# EasyEDA Pro project Motor_Driver.eprj, board PCB1
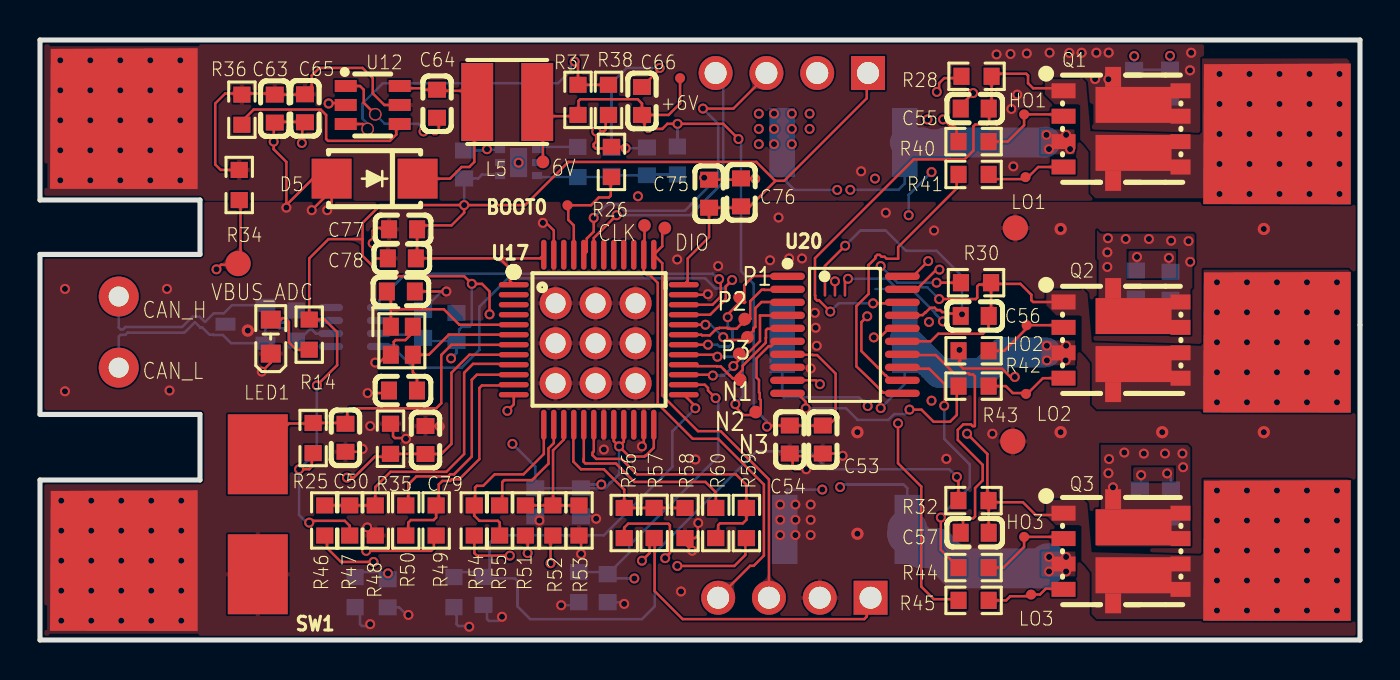
[diagram p2: board, top side]
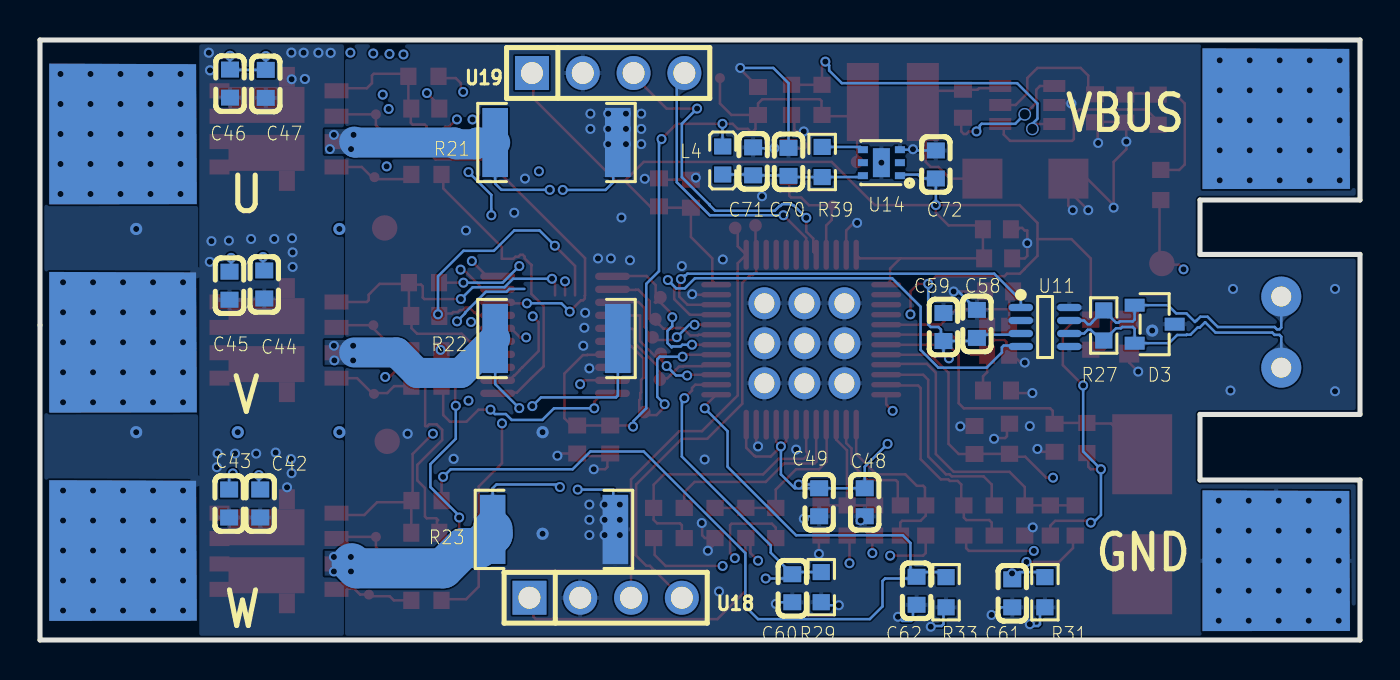
[diagram p3: board, bottom side, seen from below]

Outline 66 x 30 mm; copper layers: Top Layer, Inner1, Inner2, Bottom Layer. Coordinates in mm from the lower left corner of the outline.
Outline path: 0,30 66,30 66,0 0,0 0,8 8,8 8,11.28 0,11.28 0,19.28 8,19.28 8,22 0,22 0,30
Stack: Top Layer 0.035mm 外层铜厚1oz / Dielectric1 0.2104mm 7628 RC49% 8.6mil / Inner1 0.0152mm 内层铜厚 / Dielectric2 1.065mm 1.1mm H/HOZ Copper / Inner2 0.0152mm 内层铜厚 / Dielectric3 0.2104mm 7628 RC49% 8.6mil / Bottom Layer 0.035mm 外层铜厚1oz

## Design rules (mm)
net CANH: CAN
net CANL: CAN
template: 自定义配置
spacing copperThickness1oz (default): track to track 0.102, other pairs 0.152 to 0.3
spacing copperThickness2oz: track to track 0.203, other pairs 0.152 to 0.3
track width copperThickness1oz (default): min 0.127, default 0.254, max 2.54
track width copperThickness2oz: min 0.203, default 0.254, max 2.54
differential pair differentialPair (default): width min 0.127, default 0.254, max 2.54; gap min 0.152, default 0.152
via viaSize (default): diameter min 0.5, default 0.61, max 10; hole min 0.3, default 0.305, max 6.3

## Placement (name value [footprint] x y rotation side)
+6V  -  [Test-Point-0.5mm]  32 28.09 0 top
BOOT0  -  [Test-Point-0.5mm]  26.37 21.74 0 top
C42  10uF  [C0603]  54.99 6.82 270 bottom
C43  4.7uF  [C0603]  56.54 6.82 270 bottom
C44  10uF  [C0603]  54.79 17.78 270 bottom
C45  4.7uF  [C0603]  56.53 17.72 270 bottom
C46  10uF  [C0603]  56.5 27.82 270 bottom
C47  4.7uF  [C0603]  54.71 27.81 270 bottom
C48  10nF  [C0603]  24.76 6.89 90 bottom
C49  1uF  [C0603]  27.04 6.89 90 bottom
C50  100nF  [C0603]  15.27 10.11 90 top
C53  100nF  [C0603]  39.14 10.02 90 top
C54  10uF  [C0603]  37.49 10.02 90 top
C55  470nF  [C0603]  46.74 26.57 180 top
C56  470nF  [C0603]  46.74 16.2 180 top
C57  470nF  [C0603]  46.74 5.36 0 top
C58  100nF  [C0603]  19.15 15.8 90 bottom
C59  1uF  [C0603]  20.83 15.65 90 bottom
C60  68nF  [C0603]  28.38 2.59 90 bottom
C61  68nF  [C0603]  17.39 2.33 90 bottom
C62  68nF  [C0603]  22.17 2.46 90 bottom
C63  4.7uF  [C0603]  11.74 26.57 90 top
C64  100nF  [C0603]  19.85 26.81 270 top
C65  100nF  [C0603]  13.25 26.58 90 top
C66  10uF  [C0603]  30.1 26.95 270 top
C70  100nF  [C0603]  28.57 23.91 270 bottom
C71  1uF  [C0603]  30.34 23.93 270 bottom
C72  4.7uF  [C0603]  21.21 23.78 270 bottom
C75  100nF  [C0603]  33.45 22.31 270 top
C76  1uF  [C0603]  35.05 22.38 270 top
C77  100nF  [C0603]  18.15 20.53 0 top
C78  1uF  [C0603]  18.09 19.08 0 top
C79  100nF  [C0603]  19.27 10 270 top
C82  10pF  [C0603]  18.04 17.43 180 top
C83  10pF  [C0603]  18.15 12.47 0 top
D3  PESD2CANFD24V-TR  [SOT-23-3_L2.9-W1.3-P1.90-LS2.4-BR]  10.27 15.79 0 bottom
D5  SS310  [DO-214AC_L4.3-W2.4-LS4.7-RD]  16.73 23.07 180 top
HO1  -  [Test-Point-0.5mm]  49.21 26.28 0 top
HO2  -  [Test-Point-0.5mm]  49.33 15.74 0 top
HO3  -  [Test-Point-0.5mm]  49.21 5.16 0 top
L4  BLM18PG121SN1D  [L0603]  31.87 23.98 270 bottom
L5  33uH  [IND-SMD_L4.0-W4.0_FNR40XXS]  23.36 26.9 0 top
LED1  LED  [LED0603-FD]  11.54 15.17 270 top
LO1  -  [Test-Point-0.5mm]  49.28 23.14 0 top
LO2  -  [Test-Point-0.5mm]  49.3 12.31 0 top
LO3  -  [Test-Point-0.5mm]  49.55 2.27 0 top
NOREF  -  [Pad_e484]  3.94 13.62 0 top
NOREF#2  -  [Pad_e2578]  61.85 14.88 0 top
NOREF#3  -  [Pad_e12919]  25.78 12.84 0 top
NOREF#4  -  [Pad_e482]  3.94 17.17 0 top
NOREF#5  -  [Pad_e2576]  61.85 4.47 0 top
NOREF#6  -  [Pad_e8259]  34.98 17.14 0 top
NOREF#7  -  [Pad_e8297]  48.64 9.93 0 top
NOREF#8  -  [Pad_e2573]  4.19 3.96 0 top
NOREF#9  -  [Pad_e2575]  61.85 14.88 0 top
NOREF#10  -  [Pad_e12925]  29.78 16.84 0 top
NOREF#11  -  [Pad_e8261]  35.24 16.05 0 top
NOREF#12  -  [Pad_e12924]  27.78 16.84 0 top
NOREF#13  -  [Pad_e8267]  35.79 11.4 0 top
NOREF#14  -  [Pad_e8296]  48.77 20.6 0 top
NOREF#15  -  [Pad_e2579]  61.85 4.47 0 top
NOREF#16  -  [Pad_e8264]  35.38 15.13 0 top
NOREF#17  -  [Pad_e2574]  61.85 25.3 0 top
NOREF#18  -  [Pad_e8265]  34.96 14.31 0 top
NOREF#19  -  [Pad_e12921]  29.78 12.84 0 top
NOREF#20  -  [Pad_e8281]  31.24 20.6 0 top
NOREF#21  -  [Pad_e2581]  4.19 26.06 0 top
NOREF#22  -  [Pad_e8280]  30.22 20.73 0 top
NOREF#23  -  [Pad_e12920]  29.78 14.84 0 top
NOREF#24  -  [Pad_e8266]  35.01 13.02 0 top
NOREF#25  -  [Pad_e2577]  61.85 25.3 0 top
NOREF#26  -  [Pad_e2580]  4.19 3.96 0 top
NOREF#27  -  [Pad_e12917]  27.78 12.84 0 top
NOREF#28  -  [Pad_e12923]  27.78 14.84 0 top
NOREF#29  -  [Pad_e12926]  25.78 14.84 0 top
NOREF#30  -  [Pad_e2572]  4.19 26.06 0 top
NOREF#31  -  [Pad_e8289]  25.15 23.9 0 top
NOREF#32  -  [Pad_e8298]  9.91 18.82 0 top
NOREF#33  -  [Pad_e12922]  25.78 16.84 0 top
Q1  XRS60V06F  [PDFN-8_L5.8-W4.9-P1.27-LS6.1-BL-1]  54.1 25.56 270 top
Q2  XRS60V06F  [PDFN-8_L5.8-W4.9-P1.27-LS6.1-BL-1]  54.1 15 270 top
Q3  XRS60V06F  [PDFN-8_L5.8-W4.9-P1.27-LS6.1-BL-1]  54.1 4.44 270 top
R14  1kΩ  [R0603]  13.46 15.27 270 top
R21  5mΩ  [R2512]  40.17 24.87 0 bottom
R22  5mΩ  [R2512]  40.17 15.08 0 bottom
R23  5mΩ  [R2512]  40.3 5.53 0 bottom
R25  10K  [R0603]  13.66 10.1 270 top
R26  10K  [R0603]  28.57 23.9 270 top
R27  120  [R0603]  12.81 15.73 90 bottom
R28  100K  [R0603]  46.83 28.18 0 top
R29  5.1K  [R0603]  26.94 2.64 90 bottom
R30  100K  [R0603]  46.8 17.87 0 top
R31  5.1K  [R0603]  15.75 2.39 90 bottom
R32  100K  [R0603]  46.67 6.97 0 top
R33  5.1K  [R0603]  20.7 2.39 90 bottom
R34  100K  [R0603]  9.96 22.75 90 top
R35  5.1K  [R0603]  17.53 10.06 270 top
R36  100K  [R0603]  10.09 26.52 270 top
R37  68K  [R0603]  26.9 27 270 top
R38  10K  [R0603]  28.42 27 90 top
R39  100K  [R0603]  26.89 23.9 270 bottom
R40  10  [R0603]  46.68 24.92 0 top
R41  10  [R0603]  46.68 23.28 180 top
R42  10  [R0603]  46.68 14.46 0 top
R43  10  [R0603]  46.68 12.69 180 top
R44  10  [R0603]  46.68 3.62 180 top
R45  10  [R0603]  46.68 1.98 180 top
R46  5K  [R0603]  14.24 5.98 90 top
R47  240K  [R0603]  15.48 5.98 270 top
R48  240K  [R0603]  16.76 5.98 90 top
R49  5K  [R0603]  19.81 5.98 270 top
R50  120K  [R0603]  18.29 5.98 270 top
R51  5K  [R0603]  24.27 5.98 90 top
R52  240K  [R0603]  25.64 5.98 270 top
R53  240K  [R0603]  26.95 5.98 90 top
R54  5K  [R0603]  21.71 5.98 270 top
R55  120K  [R0603]  22.98 5.98 270 top
R56  5K  [R0603]  29.21 5.85 90 top
R57  240K  [R0603]  30.71 5.85 270 top
R58  240K  [R0603]  32.25 5.85 90 top
R59  5K  [R0603]  35.32 5.85 270 top
R60  120K  [R0603]  33.79 5.85 270 top
SW1  -  [实验室微型开关]  9.37 1.25 90 top
U11  TCAN3414DDFR  [TSOT-23-8_L2.9-W1.6-P0.65-LS2.8-BR]  15.75 15.65 0 bottom
U12  LMR16006XDDCR  [SOT-23-6_L2.9-W1.6-P0.95-LS2.8-BR]  16.64 26.75 180 top
U14  NCP718AMT330TBG  [WDFN-6_L2.0-W2.0-P0.65-BL-EP]  23.93 23.87 90 bottom
U17  STM32G431CBT6  [LQFP-48_L7.0-W7.0-P0.50-LS9.0-BL]  27.94 15.01 270 top
U18  HX PZ2.54-1x4P ZZ  [HDR-TH_4P-P2.54-V-M]  37.72 2.11 180 bottom
U19  HX PZ2.54-1x4P ZZ  [HDR-TH_4P-P2.54-V-M]  37.59 28.35 180 bottom
U20  DRV8300DPWR  [TSSOP-20_L6.5-W4.4-P0.65-LS6.4-BL]  40.25 15.26 270 top
X1  16MHz  [CRYSTAL-SMD_4P-L2.0-W1.6-BL_XL7EL89COI-111YLC-16M]  18.09 14.96 270 top

## Footprints (pads in the part's own frame, mm; a bottom-side part is the same pattern mirrored in y, then rotated)
C0603
  rect 0.8x0.9 smd: 1(-0.7,0) 2(0.7,0)
CRYSTAL-SMD_4P-L2.0-W1.6-BL_XL7EL89COI-111YLC-16M
  rect 0.9x0.8 smd: 1(-0.7,-0.55) 2(0.7,-0.55) 3(0.7,0.55) 4(-0.7,0.55)
DO-214AC_L4.3-W2.4-LS4.7-RD
  rect 2x2 smd: 1(-2.15,0) 2(2.15,0)
HDR-TH_4P-P2.54-V-M
  rect 1.7x1.7 hole 1.1: 1(-3.81,0)
  round 1.7 hole 1.1: 2(-1.27,0) 3(1.27,0) 4(3.81,0)
IND-SMD_L4.0-W4.0_FNR40XXS
  rect 1.6x3.9 smd: 1(-1.5,0) 2(1.5,0)
L0603
  rect 0.8x0.864 smd: 1(-0.7,0) 2(0.7,0)
LED0603-FD
  rect 0.9x1 smd: 1(-0.85,0) 2(0.85,0)
LQFP-48_L7.0-W7.0-P0.50-LS9.0-BL
  oval 0.27x1.5 smd: 1(-2.75,-4.25) 2(-2.25,-4.25) 3(-1.75,-4.25) 4(-1.25,-4.25) 5(-0.75,-4.25) 6(-0.25,-4.25) 7(0.25,-4.25) 8(0.75,-4.25) 9(1.25,-4.25) 10(1.75,-4.25) 11(2.25,-4.25) 12(2.75,-4.25) 25(2.75,4.25) 26(2.25,4.25) 27(1.75,4.25) 28(1.25,4.25) 29(0.75,4.25) 30(0.25,4.25) 31(-0.25,4.25) 32(-0.75,4.25) 33(-1.25,4.25) 34(-1.75,4.25) 35(-2.25,4.25) 36(-2.75,4.25)
  oval 1.5x0.27 smd: 13(4.25,-2.75) 14(4.25,-2.25) 15(4.25,-1.75) 16(4.25,-1.25) 17(4.25,-0.75) 18(4.25,-0.25) 19(4.25,0.25) 20(4.25,0.75) 21(4.25,1.25) 22(4.25,1.75) 23(4.25,2.25) 24(4.25,2.75) 37(-4.25,2.75) 38(-4.25,2.25) 39(-4.25,1.75) 40(-4.25,1.25) 41(-4.25,0.75) 42(-4.25,0.25) 43(-4.25,-0.25) 44(-4.25,-0.75) 45(-4.25,-1.25) 46(-4.25,-1.75) 47(-4.25,-2.25) 48(-4.25,-2.75)
Pad_e482
  round 2 hole 1: 1(0,0)
Pad_e484
  round 2 hole 1: 1(0,0)
Pad_e2572
  custom 0x0 smd: 1(0,0)
Pad_e2573
  custom 0x0 smd: 1(0,0)
Pad_e2574
  custom 0x0 smd: 1(0,0)
Pad_e2575
  custom 0x0 smd: 1(0,0)
Pad_e2576
  custom 0x0 smd: 1(0,0)
Pad_e2577
  custom 0x0 smd far side: 1(0,0)
Pad_e2578
  custom 0x0 smd far side: 1(0,0)
Pad_e2579
  custom 0x0 smd far side: 1(0,0)
Pad_e2580
  custom 0x0 smd far side: 1(0,0)
Pad_e2581
  custom 0x0 smd far side: 1(0,0)
Pad_e8259
  round 0.635 smd: 1(0,0)
Pad_e8261
  round 0.635 smd: 1(0,0)
Pad_e8264
  round 0.635 smd: 1(0,0)
Pad_e8265
  round 0.635 smd: 1(0,0)
Pad_e8266
  round 0.635 smd: 1(0,0)
Pad_e8267
  round 0.635 smd: 1(0,0)
Pad_e8280
  round 0.635 smd: 1(0,0)
Pad_e8281
  round 0.635 smd: 1(0,0)
Pad_e8289
  round 0.635 smd: 1(0,0)
Pad_e8296
  round 1.27 smd: 1(0,0)
Pad_e8297
  round 1.27 smd: 1(0,0)
Pad_e8298
  round 1.27 smd: 1(0,0)
Pad_e12917
  round 1.6 hole 1: 1(0,0)
Pad_e12919
  round 1.6 hole 1: 1(0,0)
Pad_e12920
  round 1.6 hole 1: 1(0,0)
Pad_e12921
  round 1.6 hole 1: 1(0,0)
Pad_e12922
  round 1.6 hole 1: 1(0,0)
Pad_e12923
  round 1.6 hole 1: 1(0,0)
Pad_e12924
  round 1.6 hole 1: 1(0,0)
Pad_e12925
  round 1.6 hole 1: 1(0,0)
Pad_e12926
  round 1.6 hole 1: 1(0,0)
PDFN-8_L5.8-W4.9-P1.27-LS6.1-BL-1
  rect 0.75x1.2 smd: 1(-1.905,-2.925) 2(-0.635,-2.925) 3(0.635,-2.925) 4(1.905,-2.925)
  rect 0.75x1 smd: 5(1.905,2.925) 6(0.635,2.925) 7(-0.635,2.925) 8(-1.905,2.925)
  rect 1x0.8 smd: 9(-2.6,-0.445) 10(2.6,-0.445)
  rect 1.8x3.8 smd: 9(-1.2,0.575) 10(1.2,0.575)
R0603
  rect 0.806x0.864 smd: 1(-0.753,0) 2(0.753,0)
R2512
  rect 1.282x3.456 smd: 1(-3.067,0) 2(3.067,0)
SOT-23-3_L2.9-W1.3-P1.90-LS2.4-BR
  rect 1x0.65 smd: 1(1,-0.95) 2(1,0.95) 3(-1,0)
SOT-23-6_L2.9-W1.6-P0.95-LS2.8-BR
  rect 1.1x0.6 smd: 1(1.35,-0.95) 2(1.35,0) 3(1.35,0.95) 4(-1.35,0.95) 5(-1.35,0) 6(-1.35,-0.95)
Test-Point-0.5mm
  round 0.5 smd: 1(0,0)
TSOT-23-8_L2.9-W1.6-P0.65-LS2.8-BR
  oval 1.222x0.364 smd: 1(1.211,-0.975) 2(1.211,-0.325) 3(1.211,0.325) 4(1.211,0.975) 5(-1.211,0.975) 6(-1.211,0.325) 7(-1.211,-0.325) 8(-1.211,-0.975)
TSSOP-20_L6.5-W4.4-P0.65-LS6.4-BL
  oval 0.364x1.742 smd: 1(-2.925,-2.871) 2(-2.275,-2.871) 3(-1.625,-2.871) 4(-0.975,-2.871) 5(-0.325,-2.871) 6(0.325,-2.871) 7(0.975,-2.871) 8(1.625,-2.871) 9(2.275,-2.871) 10(2.925,-2.871) 11(2.925,2.871) 12(2.275,2.871) 13(1.625,2.871) 14(0.975,2.871) 15(0.325,2.871) 16(-0.325,2.871) 17(-0.975,2.871) 18(-1.625,2.871) 19(-2.275,2.871) 20(-2.925,2.871)
WDFN-6_L2.0-W2.0-P0.65-BL-EP
  rect 0.35x0.5 smd: 1(-0.65,-0.925) 2(0,-0.925) 3(0.65,-0.925) 4(0.65,0.925) 5(0,0.925) 6(-0.65,0.925)
  rect 1.45x0.85 smd: 7(0,0)
实验室微型开关
  custom 4x3 smd: 1(2.032,-1.524) 2(8.032,-1.524)

## Nets
3V3: C48.2 C49.2 C58.1 C59.1 C72.2 C75.2 C76.2 C77.2 C78.2 R14.1 R25.2 R47.2 R52.2 R57.2 U11.3 U14.1 U17.1 U17.20 U17.21 U17.24 U17.36 U17.48 U18.1 U19.1
+6V: +6V.1 C53.2 C54.2 C66.2 L4.1 L5.2 NOREF#31.1 R37.2 U20.7
GND: C42.1 C43.1 C44.1 C45.1 C46.1 C47.1 C48.1 C49.1 C50.1 C53.1 C54.1 C58.2 C59.2 C60.1 C61.1 C62.1 C63.1 C65.1 C66.1 C70.1 C71.1 C72.1 C75.1 C76.1 C77.1 C78.1 C79.1 C82.1 C83.1 D3.3 D5.2 LED1.2 NOREF#3.1 NOREF#7.1 NOREF#8.1 NOREF#10.1 NOREF#12.1 NOREF#14.1 NOREF#19.1 NOREF#23.1 NOREF#26.1 NOREF#27.1 NOREF#28.1 NOREF#29.1 NOREF#33.1 R21.1 R22.1 R23.1 R26.1 R29.1 R31.1 R33.1 R35.1 R38.1 R48.1 R49.2 R53.1 R54.2 R58.1 R59.2 SW1.1 U11.2 U11.5 U11.8 U12.2 U14.3 U14.7 U17.19 U17.23 U17.35 U17.47 U18.2 U19.2 U20.8 X1.2 X1.4
VBUS: C42.2 C43.2 C44.2 C45.2 C46.2 C47.2 C63.2 C65.2 NOREF#21.1 NOREF#30.1 Q1.7 Q1.8 Q1.9 Q2.7 Q2.8 Q2.9 Q3.7 Q3.8 Q3.9 R34.2 R36.1 U12.5
ADC1_VBUS: C79.2 NOREF#32.1 R34.1 R35.2 U17.8
CANH: D3.1 NOREF#4.1 R27.2 U11.7
CANL: D3.2 NOREF.1 R27.1 U11.6
FDCAN1_RX: U11.4 U17.33
FDCAN1_TX: U11.1 U17.34
HO1: HO1.1 Q1.2 R40.2
HO2: HO2.1 Q2.2 R42.2
HO3: HO3.1 Q3.2 R44.1
LO1: LO1.1 Q1.4 R41.1
LO2: LO2.1 Q2.4 R43.1
LO3: LO3.1 Q3.4 R45.1
MOTOR_U: C55.1 NOREF#17.1 NOREF#25.1 Q1.1 Q1.5 Q1.6 Q1.10 R28.2 U20.18
MOTOR_V: C56.1 NOREF#2.1 NOREF#9.1 Q2.1 Q2.5 Q2.6 Q2.10 R30.2 U20.15
MOTOR_W: C57.2 NOREF#5.1 NOREF#15.1 Q3.1 Q3.5 Q3.6 Q3.10 R32.2 U20.12
OPA_OUT_U: R50.1 U17.10
OPA_OUT_V: R55.1 U17.14
OPA_OUT_W: R60.1 U17.17
OPA_VINN_U: R49.1 R50.2 U17.11
OPA_VINN_V: R54.1 R55.2 U17.13
OPA_VINN_W: R59.1 R60.2 U17.18
OPA_VINP_U: R46.2 R47.1 R48.2 U17.9
OPA_VINP_V: R51.2 R52.1 R53.2 U17.15
OPA_VINP_W: R56.2 R57.1 R58.2 U17.16
OSC_IN: C82.2 U17.5 X1.1
OSC_OUT: C83.2 U17.6 X1.3
PHASE_U_ADC: C60.2 R28.1 R29.2 U17.26
PHASE_V_ADC: C61.2 R30.1 R31.2 U17.12
PHASE_W_ADC: C62.2 R32.1 R33.2 U17.25
SENU_P: Q1.3 R21.2 R46.1
SENV_P: Q2.3 R22.2 R51.1
SENW_P: Q3.3 R23.2 R56.1
SWCLK: NOREF#22.1 U17.38 U18.4
SWDIO: NOREF#20.1 U17.37 U18.3
TIM_CH1: NOREF#6.1 U17.30 U20.1
TIM_CH1N: NOREF#18.1 U17.27 U20.4
TIM_CH2: NOREF#11.1 U17.31 U20.2
TIM_CH2N: NOREF#24.1 U17.28 U20.5
TIM_CH3: NOREF#16.1 U17.32 U20.3
TIM_CH3N: NOREF#13.1 U17.29 U20.6
UART_RX: U17.44 U19.3
UART_TX: U17.43 U19.4
$1N3867: LED1.1 R14.2
$1N8632: R36.2 U12.4
$1N8748: C64.2 U12.1
$1N8755: C64.1 D5.1 L5.1 U12.6
$1N8903: R37.1 R38.2 U12.3
$1N10119: C70.2 C71.2 L4.2 R39.2 U14.6
$1N14795: R39.1 U14.4
$1N25856: BOOT0.1 R26.2 U17.45
$1N26138: C50.2 R25.1 SW1.2 U17.7
$2N28004: R41.2 U20.11
$2N28109: R45.2 U20.9
$2N28121: R43.2 U20.10
$2N28169: R40.1 U20.19
$2N28215: R42.1 U20.16
$2N28287: R44.2 U20.13
$2N28379: C55.2 U20.20
$2N28399: C56.2 U20.17
$2N28418: C57.1 U20.14

Pads without a net: U14 2 5; U17 2 3 4 22 39 40 41 42 46

## Via types
v1: diameter 0.5, hole 0.305, Top Layer to Bottom Layer, 328 vias
v2: diameter 0.61, hole 0.305, Top Layer to Bottom Layer, 8 vias
v3: diameter 0.508, hole 0.305, Top Layer to Bottom Layer, 10 vias
v4: diameter 0.635, hole 0.508, Top Layer to Bottom Layer, 2 vias

## Routing (per net, layer and track width the routed paths; a pad name or vN(x,y) marks a point on that pad's centre or on a via; arc(x,y) is an arc through that point)
3V3: length 143.9
  Top Layer w0.127: 22.98,19.08 25.01,19.08 U17.48 ; 22.98,19.08 23.49,18.57 23.49,17.96 U17.1 ; 22.98,19.08 C78.2 18.85,19.15 C77.2 19.05,20.73 20.57,20.73 21.21,21.36 v1(21.21,21.75) ; v1(21.21,21.75) 17.02,21.75 16.13,20.86 16.13,20.04 ; v1(21.21,21.75) 24.26,21.75 26.41,23.9 35.81,23.9 36.76,22.96 36.77,22.96 ; U17.21 29.19,9.91 v1(28.96,9.68) ; v1(22.48,16.28) 22.48,17.43 22.1,17.81 v1(21.59,17.81) 21.21,18.19 17.78,18.19 17.65,18.32 17,18.32 16.78,18.54 16.78,18.56 16.13,19.2 16.13,20.04 ; v1(30.1,3.97) 30.48,4.35 30.48,4.87 R57.2 30.73,5.07 30.73,2.44 32.13,1.04 41.21,1.04 41.34,1.17 41.34,1.92 U18.1 ; v1(13.46,5.87) 13.59,5.87 13.68,5.96 15.24,5.96 15.48,5.71 R47.2 ; U19.1 41.34,28.29 41.34,27.09 37.21,22.96 36.77,22.96 ; 36.77,22.96 35.49,21.68 C76.2 34.99,21.61 C75.2 33.45,20.15 32.38,19.08 32.38,17.96 U17.36 ; v1(25.53,3.84) 25.53,5.1 R52.2 ; v1(28.96,9.68) 29.46,9.17 30.22,9.17 30.27,9.21 30.29,9.21 30.69,9.61 U17.24 ; v1(28.96,9.68) 28.69,9.95 U17.20 ; v1(13.84,12.73) 14.86,13.74 14.86,15.39 14.23,16.02 R14.1 13.46,19.08 14.43,20.04 16.13,20.04 ; v1(12.95,8.54) 13.46,8.54 13.59,8.66 13.59,9.28 13.66,9.35
  Inner1 w0.127: v1(30.1,3.97) 29.21,3.97 28.19,4.98 ; v1(28.07,7.78) 28.32,7.52 28.32,5.11 28.19,4.98 ; v1(25.53,3.84) 27.32,3.84 28.19,4.71 28.19,4.98
  Inner2 w0.127: v1(22.48,16.28) 22.73,16.28 24.13,14.89 24.13,10.57 23.62,10.06 v1(23.62,9.81)
  Bottom Layer w0.127: v1(21.21,21.75) C72.2 21.91,23.08 22.1,23.27 22.95,23.27 U14.1 ; v1(28.07,7.78) 27.23,7.78 C49.2 ; v1(13.46,5.87) 13.33,5.87 12.95,6.25 v1(12.95,8.54) 13.84,9.43 v1(13.84,12.73) ; v1(28.96,9.68) 28.96,8.28 28.26,7.59 C49.2 ; C59.1 20.83,14.36 v1(20.55,14.08) ; C59.1 20.95,15.08 20.95,15.52 21.08,15.65 21.46,15.65 21.59,15.78 v1(21.59,17.81) ; C59.1 19.31,14.95 C58.1 18.99,15.27 17.01,15.27 U11.3 ; C49.2 C48.2 24.76,8.66 v1(23.62,9.81)
+6V: length 43.3
  Top Layer w0.127: C66.2 30.22,26.12 30.22,25.56 30.35,25.43 30.48,25.43 30.61,25.56 31.11,25.56 31.37,25.81 v1(31.88,25.81) 34.16,25.81 v1(34.92,25.05) ; C66.2 31.43,26.25 32,26.83 32,27.97 32.13,28.09 ; C66.2 30.1,26.83 29.89,27.04 27.01,27.04 26.92,26.95 26.92,26.27 R37.2 26.84,26.19 25.57,26.19 25.15,26.62 ; 25.15,26.62 L5.2 ; 25.15,26.62 NOREF#31.1 ; 37.94,14.26 38.63,14.26 38.64,14.25 38.86,14.25 39.78,13.32 39.78,11.09 39.31,10.62 ; C53.2 C54.2 36.4,10.72 v1(36.35,10.67)
  Bottom Layer w0.127: L4.1 31.88,24.69 v1(31.88,25.81) ; v1(36.35,10.67) 36.32,10.7 36.19,10.7 36.32,10.82 36.32,10.95 35.69,11.58 35.69,17.81 35.05,18.44 35.05,24.92 v1(34.92,25.05)
GND: length 165.5
  Top Layer w0.127: R53.1 27.05,5.12 v1(27.05,4.3) ; v1(16.76,13.87) 16.97,13.87 17.43,14.33 17.61,14.33 17.69,14.41 17.69,14.91 17.78,15 18.27,15 18.64,15.37 X1.4 ; R54.2 21.72,5.22 21.72,4.35 21.84,4.22 v1(23.49,4.22) ; v1(31.87,3.7) 34.72,3.7 35.27,4.25 35.27,4.82 35.32,4.87 R59.2 ; C78.1 17.39,19.08 16.76,19.08 16.64,19.2 v1(16.64,19.84) 16.64,20.47 16.76,20.47 16.89,20.6 17.02,20.6 17.08,20.53 C77.1 ; 38.37,8.54 37.74,8.54 37.63,8.65 37.63,9.19 ; U17.47 25.69,20.47 25.31,20.86 v1(25.15,20.86) ; 12.32,21.75 13.64,23.07 D5.2 ; 12.32,21.75 v1(12.32,21.62) ; 12.32,21.75 12.32,23.9 11.68,24.54 11.68,24.86 11.69,25.63 11.67,25.65 ; U17.35 33.36,17.26 v1(33.39,17.29) ; v1(35.76,23.06) 35.74,23.08 C76.1 34.99,23.02 C75.1 ; C54.1 37.51,9.32 ; v1(30.1,9.68) 30.19,9.77 U17.23 ; v1(16.31,4.46) 19.56,4.46 19.69,4.59 19.69,5.11 R49.2 ; 13.11,24.86 13.11,25.66 13.15,25.69 ; LED1.2 11.54,13.87 v1(11.09,13.42) ; 14.5,26.84 15.03,26.84 15.09,26.79 ; v1(16.13,9.55) 15.98,9.41 C50.1 ; v1(16.38,12.35) 17.32,12.35 C83.1 ; v1(18.3,10.06) 18.26,10.1 17.74,10.1 17.65,10.19 17.65,10.69 R35.1 ; v1(30.99,28.6) 30.99,28.54 C66.1 ; 39.01,9.23 38.98,9.2 37.78,9.2 ; C53.1 40.02,9.32 v1(40.13,9.21) ; 13.03,25.88 13,25.91 11.71,25.91 ; v1(13.59,21.49) 14.58,22.48 14.58,21.71 v1(14.36,21.49) ; v1(29.28,24.59) 29.21,24.66 R26.1 28.49,24.58 27.78,24.58 27.69,24.67 27.69,24.79 27.81,24.92 v1(27.81,25.43) 28.19,25.43 28.28,25.52 28.28,26.11 R38.1 ; R48.1 16.76,5.23 v1(16.36,5.63) ; C79.1 19.96,10.7 v1(19.98,10.68) ; v1(32.61,4.46) 32.25,4.82 R58.1 32.75,5.1 32.89,5.23 32.89,5.83 v1(32.91,5.85) ; C82.1 20.19,17.43
  Inner2 w0.127: v1(31.87,3.7) 33.21,3.7 33.65,4.15 33.65,7.55 33.91,7.8 38.58,7.8 38.86,7.52 v1(39.12,7.52) ; v1(39.86,22.5) 39.86,22.18 38.13,20.45 25.63,20.45 16.89,11.71 16.89,5.03 v1(16.31,4.46) ; 32.84,9.91 32.87,9.93 35.81,9.93 35.83,9.92 41.52,9.92 41.53,9.93 41.53,11.55 v1(41.38,11.7) ; 32.84,9.91 32.54,9.91 31.9,9.27 31.9,8.72 28.29,5.11 26.85,5.11 26.38,4.64 24.75,4.64 24.58,4.81 24.09,4.81 v1(23.49,4.22) ; 32.84,9.91 32.87,9.91
  Bottom Layer w0.127: R31.1 16,1.39 16,0.79 16.09,0.7 16.42,0.7 v1(16.51,0.79) ; v1(30.99,28.6) 29.34,28.6 28.57,27.84 C70.1 ; R22.1 37.11,12.22 37.2,12.13 40.95,12.13 v1(41.38,11.7) ; C58.2 20.08,17.43 v1(20.32,17.43) ; v1(54.71,29.19) 54.71,28.5 56.49,28.5 C46.1 v1(56.5,29.21) ; v1(29.21,1.81) 29.13,1.89 C60.1 ; C72.1 22.29,24.48 v1(22.35,24.54) 22.37,24.52 U14.3 ; v1(21.46,0.66) 21.43,0.7 20.92,0.7 20.83,0.79 20.83,1.51 R33.1 ; v1(29.28,24.59) 30.3,24.59 C71.1 ; C43.1 56.54,8.15 v1(56.36,8.33) ; v1(56.44,19.11) 56.44,18.5 C45.1 ; v1(18.42,1.25) 18.33,1.25 17.95,1.63 C61.1 ; v1(54.85,19.15) 54.85,18.54 C44.1 ; v1(55.06,8.25) 55.06,7.59 C42.1 ; v1(39.12,7.52) 37.34,7.52 37.34,5.63 R23.1 ; v1(26.06,1.74) 26.79,1.74 R29.1 ; v1(23.1,1.16) 22.89,0.95 22.44,0.95 22.35,1.04 22.35,1.58 C62.1 ; C49.1 27.68,6.19 v1(27.81,6.06) ; R21.1 37.34,24.65 37.34,22.89 37.72,22.5 v1(39.86,22.5)
  vias: v1(1.06,6.97) v1(1.06,5.47) v1(1.06,3.97) v1(1.06,2.47) v1(1.06,0.97) v1(1.25,17.55) v1(1.25,12.44) v1(2.56,6.97) v1(2.56,5.47) v1(2.56,3.97) v1(2.56,2.47) v1(2.56,0.97) v1(4.06,6.97) v1(4.06,5.47) v1(4.06,3.97) v1(4.06,2.47) v1(4.06,0.97) v1(5.56,6.97) v1(5.56,5.47) v1(5.56,3.97) v1(5.56,2.47) v1(5.56,0.97) v1(6.35,17.55) v1(6.48,12.47) v1(7.06,6.97) v1(7.06,5.47) v1(7.06,3.97) v1(7.06,2.47) v1(7.06,0.97) v1(11.68,24.92) v1(13.09,24.85) v1(16.51,10.7) v1(23.93,23.87) v1(24.97,5.98) v1(28.19,9.52) v1(29.9,22.19) v1(31.86,19.03) v1(32.05,2.43) v1(32.77,9.03) v1(33.21,23.11) v1(33.91,18.7) v1(35.94,26.32) v1(35.94,25.56) v1(35.94,24.79) v1(36.5,18.99) v1(36.7,26.32) v1(36.7,25.56) v1(36.7,24.79) v1(36.93,21.12) v1(37.01,6.77) v1(37.01,6.01) v1(37.01,5.25) v1(37.46,19.08) v1(37.59,26.32) v1(37.59,25.56) v1(37.59,24.79) v1(37.77,6.77) v1(37.77,6.01) v1(37.77,5.25) v1(38.1,19.08) v1(38.31,8.54) v1(38.48,26.32) v1(38.48,25.56) v1(38.53,13.58) v1(38.53,6.77) v1(38.53,6.01) v1(38.53,5.25) v1(38.74,16.36) v1(38.78,15.61) v1(38.84,14.71) v1(41.75,23.07) v1(42.29,21.36) v1(44.7,20.47) v2(10.39,15.47) v2(40.87,10.39) v2(40.87,5.31) v2(51.03,20.55) v2(51.03,10.39) v2(56.11,10.39) v2(61.19,20.55) v2(61.19,10.39) v3(14.43,26.83) v3(45.32,9.06) v3(47.62,10.31)
VBUS: length 16.1
  Top Layer w0.127: R34.2 9.04,23.5 8.76,23.78 8.76,26.83 9.26,27.32 11.76,27.32 11.81,27.27 13.5,27.27 13.53,27.24 13.59,27.3 13.59,28.22 13.97,28.6 16.13,28.6 16.64,28.09 16.64,27.33 17.22,26.75 U12.5
  vias: v1(1.02,28.98) v1(1.02,27.48) v1(1.02,25.98) v1(1.02,24.48) v1(1.02,22.98) v1(2.52,28.98) v1(2.52,27.48) v1(2.52,25.98) v1(2.52,24.48) v1(2.52,22.98) v1(4.02,28.98) v1(4.02,27.48) v1(4.02,25.98) v1(4.02,24.48) v1(4.02,22.98) v1(5.52,28.98) v1(5.52,27.48) v1(5.52,25.98) v1(5.52,24.48) v1(5.52,22.98) v1(7.02,28.98) v1(7.02,27.48) v1(7.02,25.98) v1(7.02,24.48) v1(7.02,22.98) v1(41.05,23.44) v1(47.83,29.28) v1(48.53,29.3) v1(48.57,26.55) v1(48.67,23.68) v1(48.86,27.27) v1(49.34,29.33) v1(50.48,29.37) v1(53.42,28.04) v1(53.4,20.09) v1(53.37,19.38) v1(53.37,18.65) v1(53.42,8.34) v1(53.45,9.05) v1(53.65,7.63) v1(54.22,9.37) v1(54.29,20.05) v1(55.19,9.32) v1(55.45,20.05) v1(56.25,9.32) v1(56.56,19.97) v1(57.12,9.33) v1(57.16,8.64) v1(57.43,19.94) v1(57.51,18.91) v3(51.47,29.36) v3(52.08,29.36) v3(52.82,29.36) v3(52.76,28.05) v3(53.43,29.37) v3(57.5,28.48) v3(57.56,29.36)
ADC1_VBUS: length 30.6
  Top Layer w0.127: v1(8.82,18.53) 9.06,18.77 9.45,18.77 ; 9.86,22.03 10.02,21.87 10.02,18.96 ; U17.8 21.47,14.26 20.57,13.36 20.57,9.81 20.07,9.3 C79.2 19.27,9.31 R35.2 ; 17.4,9.15 17.38,9.16 16.74,9.16 15.69,8.12 v1(15.35,8.12)
  Inner2 w0.127: 8.87,18.42 8.87,13 12.17,9.7 13.76,9.7 v1(15.35,8.12)
CANH: length 14.3
  Bottom Layer w0.127: NOREF#4.1 3.94,15.62 4.03,15.53 4.15,15.53 4.27,15.65 7.11,15.65 7.62,16.16 7.98,16.16 8.15,15.99 8.16,15.99 8.25,15.9 8.68,16.33 9.19,16.33 9.6,16.74 D3.1 11.27,16.02 11.36,15.93 12.01,15.93 12.07,15.87 12.2,15.87 R27.2 13.4,15.89 13.4,15.88 13.49,15.79 13.61,15.79 13.8,15.97 U11.7
CANL: length 14.2
  Bottom Layer w0.127: NOREF.1 3.94,15.17 4.03,15.26 4.27,15.26 4.38,15.37 7.22,15.37 7.74,15.89 7.75,15.89 8.01,15.62 8.12,15.62 8.47,15.27 8.66,15.27 8.68,15.25 9.14,15.25 9.55,14.84 D3.2 11.27,15.56 11.36,15.65 11.89,15.65 11.96,15.59 12.2,15.59 R27.1 12.93,14.97 13.46,15.51 13.61,15.51 13.8,15.32 U11.6
FDCAN1_RX: length 25.3
  Top Layer w0.127: v1(34.61,18) 34.29,17.68 34.29,17.05 33.51,16.26 U17.33
  Bottom Layer w0.127: v1(34.61,18) 34.19,17.58 33.76,17.58 33.25,18.09 23.39,18.09 21.97,16.67 21.97,14.51 21.08,13.62 18.67,13.62 17.91,14.38 17.91,14.63 17.82,14.72 17.01,14.72 U11.4
FDCAN1_TX: length 20.9
  Top Layer w0.127: v1(33.95,18.05) 34.03,17.96 34.03,17.17 33.63,16.76 U17.34
  Bottom Layer w0.127: v1(33.95,18.05) 33.77,18.23 33.72,18.23 33.63,18.32 18.29,18.32 16.96,16.99 U11.1
HO1: length 4.7
  Top Layer w0.127: Q1.2 51.09,26.28 HO1.1 49.21,25.74 48.39,24.92 R40.2
HO2: length 4.4
  Top Layer w0.127: R42.2 48.21,14.46 49.33,15.58 HO2.1 51.07,15.74 Q2.2
HO3: length 4.7
  Top Layer w0.127: R44.1 48.17,3.62 49.21,4.66 HO3.1 51.09,5.16 Q3.2
LO1: length 4.1
  Top Layer w0.127: Q1.4 49.91,23.65 49.4,23.14 LO1.1 49.18,23.04 47.67,23.04 R41.1
LO2: length 4.2
  Top Layer w0.127: Q2.4 50.15,13.09 49.36,12.31 LO2.1 49.26,12.35 48.64,12.35 48.29,12.69 R43.1
LO3: length 4
  Top Layer w0.127: Q3.4 51.14,2.57 50.29,2.57 50,2.27 LO3.1 49.47,2.19 48.51,2.19 48.31,1.98 R45.1
MOTOR_U: length 25.1
  Top Layer w0.127: 38.75,17.22 38.76,17.21 38.76,17.07 38.85,16.98 38.95,16.98 v1(39.51,16.42) ; 38.75,17.23 38.75,19.09 43.69,24.03 46.23,24.03 46.67,24.48 46.67,25.68 46.76,25.77 47.37,25.77 47.46,25.86 47.46,26.55 C55.1 47.58,26.72 R28.2 47.71,28.31 49.31,28.31 49.4,28.22 49.4,27.84 49.66,27.59 51.05,27.59 Q1.1 ; v1(41.65,16.83) 42.55,16.83 42.56,16.84
  Bottom Layer w0.127: v1(39.51,16.42) 39.93,16.83 v1(41.65,16.83)
  vias: v1(58.97,28.3) v1(58.97,26.8) v1(58.97,25.3) v1(58.97,23.8) v1(58.97,22.3) v1(60.47,28.3) v1(60.47,26.8) v1(60.47,25.3) v1(60.47,23.8) v1(60.47,22.3) v1(61.97,28.3) v1(61.97,26.8) v1(61.97,25.3) v1(61.97,23.8) v1(61.97,22.3) v1(63.47,28.3) v1(63.47,26.8) v1(63.47,25.3) v1(63.47,23.8) v1(63.47,22.3) v1(64.97,28.3) v1(64.97,26.8) v1(64.97,25.3) v1(64.97,23.8) v1(64.97,22.3)
MOTOR_V: length 18.8
  Top Layer w0.127: v1(40.4,18.06) 40.25,17.91 40.25,17.23 ; 47.42,15.94 47.42,15.59 47.14,15.31 44.91,15.31 44.54,14.94 43.86,14.94 ; v1(44.96,17.05) 46.79,17.05 46.86,17.12 46.86,17.68 46.95,17.77 47.15,17.77 ; C56.1 47.56,16.32 R30.2 47.61,17.81 49.02,17.81 49.57,17.26 49.57,16.99 49.66,16.9 Q2.1
  Bottom Layer w0.127: v1(44.96,17.05) 44.37,17.64 42.77,17.64 42.35,18.06 v1(40.4,18.06)
  vias: v1(58.85,17.89) v1(58.85,16.39) v1(58.85,14.89) v1(58.85,13.39) v1(58.85,11.89) v1(60.35,17.89) v1(60.35,16.39) v1(60.35,14.89) v1(60.35,13.39) v1(60.35,11.89) v1(61.85,17.89) v1(61.85,16.39) v1(61.85,14.89) v1(61.85,13.39) v1(61.85,11.89) v1(63.35,17.89) v1(63.35,16.39) v1(63.35,14.89) v1(63.35,13.39) v1(63.35,11.89) v1(64.85,17.89) v1(64.85,16.39) v1(64.85,14.89) v1(64.85,13.39) v1(64.85,11.89)
MOTOR_W: length 24.3
  Top Layer w0.127: R32.2 47.37,7.03 47.37,9.3 v1(46.35,10.31) ; v1(41.36,16.19) 41.07,15.89 41.07,14.44 41.88,13.64 41.89,13.64 42.03,13.49 42.03,13.47 42.26,13.24 42.29,13.24 42.57,12.96 ; Q3.1 51.09,6.25 49.78,6.25 49.15,6.89 47.51,6.89 47.44,6.96 C57.2
  Inner2 w0.127: 42.29,15.7 42.29,15.39 42.93,14.76 45.47,14.76 45.72,15.01 46.48,15.01 46.61,14.89 46.61,10.57 v1(46.35,10.31) ; 42.27,15.7 41.78,16.19 v1(41.36,16.19)
  vias: v1(58.85,7.47) v1(58.85,5.97) v1(58.85,4.47) v1(58.85,2.97) v1(58.85,1.47) v1(60.35,7.47) v1(60.35,5.97) v1(60.35,4.47) v1(60.35,2.97) v1(60.35,1.47) v1(61.85,7.47) v1(61.85,5.97) v1(61.85,4.47) v1(61.85,2.97) v1(61.85,1.47) v1(63.35,7.47) v1(63.35,5.97) v1(63.35,4.47) v1(63.35,2.97) v1(63.35,1.47) v1(64.85,7.47) v1(64.85,5.97) v1(64.85,4.47) v1(64.85,2.97) v1(64.85,1.47)
OPA_OUT_U: length 10.9
  Top Layer w0.127: R50.1 18.41,6.85 18.41,7.78 18.82,8.18 20.41,8.18 20.52,8.28 20.7,8.28 21.59,9.17 21.59,13.01 21.84,13.26 U17.10
OPA_OUT_V: length 6
  Top Layer w0.127: R55.1 23.11,6.86 23.11,7.9 23.2,7.99 24.6,7.99 25.42,8.82 25.42,9.58 25.69,9.84 U17.14
OPA_OUT_W: length 9.9
  Top Layer w0.127: U17.17 27.19,9.06 27.18,9.05 27.18,8.92 27.27,8.83 28.79,8.83 29.72,7.9 33.27,7.9 33.79,7.39 R60.1
OPA_VINN_U: length 11.8
  Top Layer w0.127: U17.11 23.65,12.73 22.1,12.73 21.97,12.6 21.97,9.05 20.95,8.03 20.59,8.03 20.51,7.95 20.12,7.95 19.94,7.78 19.94,6.86 R49.1 19.81,6.12 19.68,6 18.54,6 18.41,5.87 18.41,5.35 R50.2
OPA_VINN_V: length 9.1
  Top Layer w0.127: R55.2 22.99,5.23 22.99,5.87 22.9,5.96 21.97,5.96 21.71,6.22 R54.1 21.75,6.77 21.75,7.62 21.84,7.71 22.16,7.71 22.73,8.28 24.17,8.28 25.19,9.3 U17.13
OPA_VINN_W: length 13.8
  Top Layer w0.127: U17.18 27.69,9.43 27.63,9.37 27.63,9.24 27.81,9.06 29.07,9.06 29.84,8.28 34.8,8.28 35.32,7.76 R59.1 35.32,6.01 35.14,5.83 34,5.83 33.91,5.74 33.91,5.21 R60.2
OPA_VINP_U: length 15.3
  Top Layer w0.127: R46.2 R47.1 R48.2 16.76,7.65 17.53,8.41 20.32,8.41 21.21,9.3 21.21,13.36 21.65,13.81 23.65,13.81 U17.9
OPA_VINP_V: length 6.9
  Top Layer w0.127: U17.15 26.19,10.02 25.65,9.48 25.65,6.74 R52.1 ; R51.2 R52.1 ; R52.1 R53.2
OPA_VINP_W: length 8.7
  Top Layer w0.127: U17.16 26.67,10.74 26.67,8.92 27.05,8.54 28.2,8.54 29.21,7.52 R56.2 31.99,6.6
OSC_IN: length 8.3
  Top Layer w0.127: U17.5 20.97,15.76 20.19,16.54 17.55,16.54 17.54,16.53 ; C82.2 17.54,17.23 17.54,16.53 ; 17.54,16.53 X1.1
OSC_OUT: length 7.3
  Top Layer w0.127: C83.2 18.85,13.18 18.64,13.39 X1.3 19.44,14.26 20.45,15.27 23.69,15.27 U17.6
PHASE_U_ADC: length 61.7
  Top Layer w0.127: v1(33.78,12.09) 33.4,12.47 33.4,12.6 33.24,12.76 U17.26 ; R28.1 45.98,28.09 45.21,28.09 44.96,27.84 44.96,27.52 v1(44.84,27.41)
  Inner1 w0.127: v1(44.38,26.03) 44.84,26.49 v1(44.84,27.41) ; v1(44.45,15.9) 44.58,15.78 v1(44.58,11.97)
  Inner2 w0.127: v1(44.58,23.4) 44.38,23.6 v1(44.38,26.03) ; v1(43.43,21.24) 43.43,17.05 44.45,16.03 v1(44.45,15.9) ; v1(44.58,11.97) 44.58,2.06 43.05,0.54 30.86,0.54 30.48,0.92 30.48,2.31 v1(29.72,3.08)
  Bottom Layer w0.127: v1(29.72,3.08) 28.6,3.08 C60.2 ; v1(43.43,21.24) 43.43,22.25 v1(44.58,23.4) ; C60.2 28.27,3.4 R29.2 ; C60.2 29.46,4.37 29.46,4.73 33.91,9.17 33.91,11.97 v1(33.78,12.09)
PHASE_V_ADC: length 54.7
  Top Layer w0.127: R30.1 v1(44.83,17.87) ; v1(23.37,11.46) 23.69,11.78 U17.12
  Inner2 w0.127: v1(23.37,11.46) 18.03,6.12 18.03,4.47 17.53,3.97 17.53,3.46 v1(17.4,3.33) 17.78,2.95 18.67,2.95 21.21,5.49 21.21,6.25 24.76,9.81 24.76,17.55 25.65,18.44 32.64,18.44 33.81,19.62 39.08,19.62 39.62,19.08 41.66,19.08 v1(42.04,18.7)
  Bottom Layer w0.127: v1(17.4,3.33) 17.18,3.33 17.13,3.29 17.02,3.4 15.75,3.4 ; v1(42.04,18.7) 42.87,17.87 v1(44.83,17.87)
PHASE_W_ADC: length 50.5
  Top Layer w0.127: v1(45.85,8.16) 45.92,8.08 45.92,6.97 ; U17.25 32.76,11.69 v1(32.76,11.58)
  Bottom Layer w0.127: C62.2 22.3,3.29 ; 22.3,3.29 22.17,3.29 22.06,3.4 20.7,3.4 ; 22.3,3.29 22.48,3.47 22.48,4.85 22.86,5.23 28.19,5.23 31.62,8.66 31.62,10.44 v1(32.76,11.58) ; 22.3,3.29 22.51,3.08 23.75,3.08 23.88,2.95 23.88,1.68 24.51,1.04 30.1,1.04 30.73,1.68 30.73,4.35 35.81,9.43 38.48,9.43 39.37,8.54 45.47,8.54 v1(45.85,8.16)
SENU_P: length 51.3
  Top Layer w0.127: R46.1 14.35,5.11 14.35,4.6 15.05,3.9 v1(16.68,3.9)
  Inner2 w0.127: v1(16.68,3.9) 17.12,4.34 17.12,11.61 25.72,20.22 38.43,20.22 40.25,22.04 40.25,22.04 40.53,22.31 40.53,22.5 v1(40.51,22.51)
  Bottom Layer w0.127: R21.2 43.24,22.82 42.93,22.51 v1(40.51,22.51)
  Bottom Layer w1.5: 50.29,24.92 50.25,24.87 45.27,24.87 45.18,24.78 44.23,24.78 44.14,24.87 R21.2
  vias: v1(50.32,25.26) v1(50.45,24.55) v1(51.31,25.26) v1(51.5,24.55)
SENV_P: length 35.1
  Top Layer w0.127: R51.1 24.38,5.11 v1(24.38,4.35)
  Inner2 w0.127: v1(42.04,11.59) 42.04,9.93 41.78,9.68 32.64,9.68 32.13,9.17 32.13,8.54 28.47,4.88 26.95,4.88 26.41,4.35 v1(24.38,4.35)
  Bottom Layer w0.127: R22.2 43.24,12.8 v1(42.04,11.59)
  Bottom Layer w1.5: 50.29,14.38 48.17,14.38 47.14,13.35 44.96,13.35 R22.2
  vias: v1(50.34,14.71) v1(50.34,13.98) v1(51.31,14.71) v1(51.28,13.98)
SENW_P: length 31.2
  Top Layer w0.127: v1(31.26,4.09) 31.26,4.11 31.5,4.35 31.5,5.74 31.42,5.82 29.41,5.82 29.21,5.62 R56.1
  Inner2 w0.127: v1(31.26,4.09) 31.6,4.09 31.68,4.17 32.06,4.17 32.23,4 33.18,4 33.4,4.22 33.4,7.65 33.78,8.03 39.88,8.03 40,7.9 v1(40,7.65)
  Bottom Layer w0.127: v1(40,7.65) 40.13,7.78 43.18,7.78 43.37,7.59 R23.2
  Bottom Layer w2: R23.2 43.37,5.28 44.04,4.6 44.83,4.6 45.85,3.58 50.16,3.58 50.42,3.84
  vias: v1(50.46,4.15) v1(50.45,3.43) v1(51.31,4.15) v1(51.31,3.43)
SWCLK: length 23
  Top Layer w0.127: NOREF#22.1 30.22,19.3 U17.38 30.19,18.41 30.35,18.25 30.5,18.25 30.89,17.86 30.89,11.81 32.64,10.06 33.91,10.06 36.19,7.78 36.19,4.22 35.69,3.71 35.51,3.71 U18.4
SWDIO: length 21.8
  Top Layer w0.127: U18.3 36.45,8.03 34.03,10.44 32.9,10.44 31.11,12.23 31.11,18.84 U17.37 31.11,19.69 31.11,20.47 NOREF#20.1
TIM_CH1: length 7.9
  Top Layer w0.127: 35.22,16.89 35,16.89 34.39,16.28 v1(34.39,16.14) ; 35.22,16.89 35.26,16.89 ; 35.22,16.89 35.22,17.74 35.67,18.2 36.69,18.2 36.74,18.24 ; 35.22,16.89 35.22,16.85 ; U17.30 v1(33.4,14.76)
  Bottom Layer w0.127: v1(33.4,14.76) 33.88,14.76 33.97,14.68 34.37,14.68 34.42,14.63 34.63,14.84 34.63,15.45 34.39,15.69 v1(34.39,16.14)
TIM_CH1N: length 6.5
  Top Layer w0.127: 34.69,13.75 34.69,13.75 35.13,14.19 35.25,14.19 36,14.94 36,16.22 36.69,16.22 36.73,16.19 ; v1(33.64,13.22) 33.6,13.26 U17.27
  Bottom Layer w0.127: v1(33.64,13.22) 34.19,13.22 v1(34.67,13.7)
TIM_CH2: length 5.7
  Top Layer w0.127: 32.51,15.23 32.62,15.23 32.65,15.26 33.07,15.26 33.11,15.23 33.49,15.23 33.83,15.58 33.94,15.58 33.97,15.61 34.35,15.61 34.4,15.56 34.83,15.56 35.04,15.78 35.22,15.78 35.41,15.97 35.46,15.97 ; 35.53,16.06 35.51,16.08 35.51,16.94 36.09,17.51 36.21,17.51 36.22,17.5 36.78,17.5
TIM_CH2N: length 5.7
  Top Layer w0.127: 36.3,15.5 36.3,15.11 36.29,15.1 36.29,14.87 35.14,13.71 35.14,13.51 34.85,13.22 34.85,13.17 34.76,13.08 34.63,13.08 34.49,13.23 34.48,13.23 34.2,13.51 34.2,13.51 34.04,13.68 33.85,13.68 33.84,13.69 32.89,13.69 32.81,13.77 ; 36.72,15.56 36.37,15.56 36.33,15.52
TIM_CH3: length 6.5
  Top Layer w0.127: 35.67,15.47 35.67,15.58 35.72,15.63 ; 35.72,15.63 35.77,15.66 35.77,16.59 36.08,16.9 36.79,16.9 ; 35.72,15.63 35.76,15.66 ; U17.32 v1(33.27,15.76) ; 35.67,15.47 35.36,15.16 35.27,15.16 ; 35.35,15.11 35.25,15 34.24,15 34.12,15.12
  Bottom Layer w0.127: v1(33.27,15.76) 33.54,15.76 v1(34.16,15.14)
TIM_CH3N: length 10.9
  Top Layer w0.127: 34.72,11.7 35.18,11.25 35.73,11.25 36.04,11.56 36.04,12 35.99,12.05 35.99,12.34 35.95,12.38 35.95,13 35.82,13.12 35.82,14.08 36.44,14.69 36.56,14.69 36.73,14.87 ; v1(33.87,14.17) 33.77,14.26 U17.29
  Bottom Layer w0.127: v1(33.87,14.17) 35.01,14.17 35.14,14.04 35.14,12.16 v1(34.77,11.79)
UART_RX: length 17.1
  Top Layer w0.127: v1(33.15,26.57) 34.67,26.57 36.32,28.22 U19.3 ; U17.44 27.34,19.41 27.34,20.07 27.69,20.42 v1(27.69,21.11)
  Bottom Layer w0.127: v1(27.69,21.11) 28.32,21.75 ; 32.53,21.79 32.53,21.76 ; 32.53,21.76 33.91,23.14 33.91,25.81 v1(33.15,26.57) ; 32.53,21.76 32.53,21.75 32.25,21.47 29.26,21.47 29.02,21.7 28.98,21.7 28.9,21.79 28.42,21.79 28.36,21.73
UART_TX: length 14.1
  Top Layer w0.127: v1(28.83,21.24) 27.69,20.1 U17.43
  Bottom Layer w0.127: U19.4 34.16,27.97 34.16,22.89 32.51,21.24 v1(28.83,21.24)
$1N3867: length 3.2
  Top Layer w0.127: R14.2 12.82,14.51 12.44,14.89 12.44,15.9 12.25,16.09 12.13,16.09 12.05,16.02 LED1.1
$1N8632: length 9.8
  Top Layer w0.127: 17.81,25.72 17.81,25.27 17.5,24.96 14.4,24.96 14.31,25.05 14.31,26.25 14.03,26.52 10.68,26.52 10.13,25.97
$1N8748: length 6.9
  Top Layer w0.127: v1(19.18,25.43) 19.56,25.43 19.68,25.3 19.81,25.3 19.94,25.43 19.94,26.03 C64.2 ; 15.29,27.7 16,27.7 16.19,27.52 16.19,26.86 v4(16.76,26.29)
  Bottom Layer w0.127: v4(16.76,26.29) 17.24,25.81 18.92,25.81 19.01,25.72 19.01,25.59 v1(19.18,25.43)
$1N8755: length 10.4
  Top Layer w0.127: D5.1 20.5,23.07 21.08,23.65 21.46,23.65 21.72,23.9 21.72,26.76 L5.1 21.3,27.46 19.91,27.46 C64.1 19.12,27.51 19.05,27.59 18.1,27.59 17.99,27.7
$1N8903: length 17
  Top Layer w0.127: v1(26.73,28.92) 26.9,28.75 R37.1 R38.2 ; v4(16.38,25.56) 16.14,25.8 U12.3
  Bottom Layer w0.127: v1(26.73,28.92) 26.54,28.73 26.54,28.48 25.91,27.84 17.14,27.84 16.13,26.83 16.13,26.06 16.38,25.81 v4(16.38,25.56)
$1N10119: length 7.1
  Bottom Layer w0.127: U14.6 24.93,23.15 R39.2 28.51,23.15 C70.2 28.6,23.23 C71.2 30.39,23.28 L4.2
$1N14795: length 2.1
  Bottom Layer w0.127: 26.89,24.65 24.99,24.65 U14.4
$1N25856: length 5.9
  Top Layer w0.127: U17.45 26.69,20.73 26.41,21 26.41,21.69 BOOT0.1 27.55,21.74 27.94,22.13 28.45,22.13 28.54,22.22 28.54,23.11 R26.2
$1N26138: length 16.8
  Top Layer w0.127: 10.89,9.29 10.91,9.29 12.44,10.82 13.63,10.82 R25.1 15.23,10.85 C50.2 15.37,10.9 15.37,11.46 15.49,11.58 19.81,11.58 20.06,11.84 20.06,14.25 20.57,14.76 23.69,14.76 U17.7
$2N28004: length 14.6
  Top Layer w0.127: 41.43,18.75 41.41,18.73 ; 41.43,18.75 41.77,19.09 41.77,19.17 41.86,19.26 41.98,19.26 42.08,19.16 42.23,19.16 42.33,19.06 42.91,19.06 42.91,19.65 45.83,22.58 45.83,23.03 ; 41.43,18.75 41.43,17.3 40.82,16.69 40.82,13.68 41.45,13.07 42.16,12.37 42.54,12.37 ; 41.43,18.75 41.43,18.76
$2N28109: length 17.2
  Top Layer w0.127: 38,12.99 38.8,12.99 v1(38.99,12.79) ; v1(42.9,10.83) 42.9,8.84 44.06,7.67 44.06,2.67 44.69,2.04 46.05,2.04
  Inner2 w0.127: v1(42.9,10.83) 42.57,10.83 42.5,10.9 42.5,11.79 42.13,12.16 41.24,12.16 40.61,12.79 v1(38.99,12.79)
$2N28121: length 10.7
  Top Layer w0.127: v1(43.47,11.52) 44.07,11.52 44.68,10.91 45.5,10.91 45.84,11.25 45.84,12.57 45.91,12.64 ; v1(38.29,11.58) 38.29,11.91 37.9,12.3
  Bottom Layer w0.127: v1(43.47,11.52) 43.25,11.3 42.71,11.3 42.41,11 40.88,11 40.3,11.58 v1(38.29,11.58)
$2N28169: length 13.3
  Top Layer w0.127: 43.5,17.57 43.87,17.57 44.82,18.52 v1(44.97,18.52) ; 45.22,25.98 45.55,25.66 45.74,25.66 45.83,25.57 45.83,25.13 45.83,25.13
  Inner2 w0.127: v1(44.97,18.52) 44.81,18.36 43.7,18.36 ; 45.19,26.14 45.64,25.69 45.64,23.25 43.87,21.48 43.87,21.46 43.98,21.34 43.98,20.87 43.87,20.76 43.87,18.54 43.7,18.37 ; 45.1,26.13 45.19,26.13
  vias: v1(45.15,26.03)
$2N28215: length 27.2
  Top Layer w0.127: v1(48.74,13.15) 48.52,13.15 48.1,13.57 46.15,13.57 45.94,13.78 45.94,13.91 46,13.97 46,14.22 ; v1(41.69,15.13) 41.99,15.13 42.45,15.59 ; 39.75,17.23 v1(39.75,17.94)
  Inner2 w0.127: v1(45.97,14.51) 40.01,14.51 40.01,16.58 39.75,16.85 v1(39.75,17.94) ; v1(41.69,15.13) 41.29,15.13 41.04,15.37 41.04,15.84 40.9,15.99 40.9,16.38 41.04,16.53 41.04,16.98 41.26,17.19 41.35,17.19 41.46,17.3 41.85,17.3 42.12,17.03 42.12,16.71 43.2,15.63 44.05,15.63 44.24,15.44 45.31,15.44 45.5,15.63 46.54,15.63 48.6,13.57 48.6,13.29 v1(48.74,13.15)
$2N28287: length 20.9
  Top Layer w0.127: 43.56,13.56 44.46,13.56 45.24,12.78 45.24,11.75 ; R44.2 45.04,4.51 v1(45.04,6.12)
  Inner1 w0.127: v1(45.21,11.71) 45.21,15.87 v1(45.15,15.93)
  Bottom Layer w0.127: v1(45.21,11.71) 45.21,10.06 46.48,8.79 46.48,7.65 45.08,6.25 45.08,6.17 v1(45.04,6.12) ; v1(45.15,15.93) 44.75,16.33 44.75,16.37 43.71,17.41 42.68,17.41 42.53,17.55 41.78,17.55
$2N28379: length 11.7
  Top Layer w0.127: v1(46.65,27.35) 45.85,26.55 45.85,26.42 45.9,26.37 ; v1(44.41,18.95) 43.65,18.19 43.65,18.17
  Inner2 w0.127: v1(46.65,27.35) 46.65,22.64 45.71,21.69 45.71,20.25 v1(44.41,18.95)
$2N28399: length 14.3
  Top Layer w0.127: 39.25,17.23 39.25,18.7 v1(40.26,19.71) ; 44.49,16.58 44.28,16.37 44.26,16.37 44.13,16.24 43.72,16.24 ; 45.83,16.32 45.41,16.32 45.34,16.4 45.1,16.4 45.01,16.5 44.85,16.5 44.73,16.61 44.51,16.61
  Bottom Layer w0.127: v1(46.1,16.28) 46.1,18.19 44.83,19.46 43.31,19.46 42.29,20.47 41.02,20.47 v1(40.26,19.71)
$2N28418: length 13.4
  Top Layer w0.127: 46.15,5.75 46.15,5.94 46.1,6 46.19,6.09 46.66,6.09 46.75,6.18 46.75,7.6 47.13,7.98 47.13,8.76 45.89,10 45.89,10.51 46.16,10.78 46.55,10.78 46.63,10.69 46.73,10.69 46.74,10.71 46.74,13.19 46.65,13.28 46.48,13.28 46.42,13.34 45.7,13.34 44.79,14.25 43.31,14.25

## Copper pours and planes (outline as drawn; the poured copper is in the pictures)
GND on Top Layer: 0.36,7.62 8.23,7.62 8.23,0.31 0.36,0.31
GND on Top Layer: -4.7,32.41 78.99,32.41 78.99,-8.1 -4.7,-8.1
GND on Bottom Layer: 36.25,20.13 39.02,20.13 39.02,13.36 36.25,13.36
GND on Bottom Layer: -2.54,32.54 73.15,32.54 73.15,-4.67 -2.54,-4.67
GND on Bottom Layer: 36.57,7.13 38.89,7.13 38.89,3.71 36.57,3.71
GND on Bottom Layer: 35.73,26.83 38.48,26.83 38.48,23.14 35.73,23.14
GND on Inner1: -5.72,31.78 69.98,31.78 69.98,-3.78 -5.72,-3.78
GND on Inner2: -2.03,31.65 69.72,31.65 69.72,-4.04 -2.03,-4.04
VBUS on Top Layer: -1.91,37.11 58.16,37.11 58.16,22 -1.91,22
VBUS on Top Layer: 52.82,9.78 57.52,9.78 57.52,4.68 52.82,4.68
VBUS on Top Layer: 0.37,29.69 8.06,29.69 8.06,22.39 0.37,22.39
VBUS on Top Layer: 52.54,29.61 57.85,29.61 57.85,25.52 52.54,25.52
VBUS on Top Layer: 52.85,20.5 57.73,20.5 57.73,15.4 52.85,15.4
VBUS on Bottom Layer: 50.84,30 58,30 58,0.25 50.84,0.25
VBUS on Inner2: 0.35,34.06 58.16,34.06 58.16,22.38 0.35,22.38
MOTOR_U on Top Layer: 50.25,29.08 65.47,29.08 65.47,22.09 50.25,22.09
MOTOR_U on Inner1: 50.3,29.05 65.52,29.05 65.52,22.06 50.3,22.06
MOTOR_V on Top Layer: 50.32,18.52 65.54,18.52 65.54,11.53 50.32,11.53
MOTOR_V on Inner1: 50.3,18.51 65.52,18.51 65.52,11.52 50.3,11.52
MOTOR_W on Top Layer: 50.31,8.03 65.53,8.03 65.53,1.04 50.31,1.04
MOTOR_W on Inner1: 50.3,7.97 65.52,7.97 65.52,0.98 50.3,0.98
SENU_P on Top Layer: 50.04,25.53 51.73,25.53 51.73,24.28 50.04,24.28
SENU_P on Bottom Layer: 50.08,25.54 51.77,25.54 51.77,24.3 50.08,24.3
SENV_P on Top Layer: 50.06,14.98 51.75,14.98 51.75,13.74 50.06,13.74
SENV_P on Bottom Layer: 50.08,15 51.77,15 51.77,13.76 50.08,13.76
SENW_P on Top Layer: 50.08,4.42 51.77,4.42 51.77,3.18 50.08,3.18
SENW_P on Bottom Layer: 50.08,4.46 51.77,4.46 51.77,3.22 50.08,3.22

Small or netless copper shapes (teardrops, artwork), in the pictures only: 213 on Top Layer, 104 on Bottom Layer, 6 on Inner1, 16 on Inner2

## Text on the board
Bottom Silkscreen Layer: GND | VBUS | V | U | W
Top Silkscreen Layer: CAN_H | CAN_L | VBUS_ADC | 6V | CLK | DIO | N2 | P2 | P3 | N1 | N3 | P1
